# EAGLE design motorcontrol (EAGLE 7.7.0)
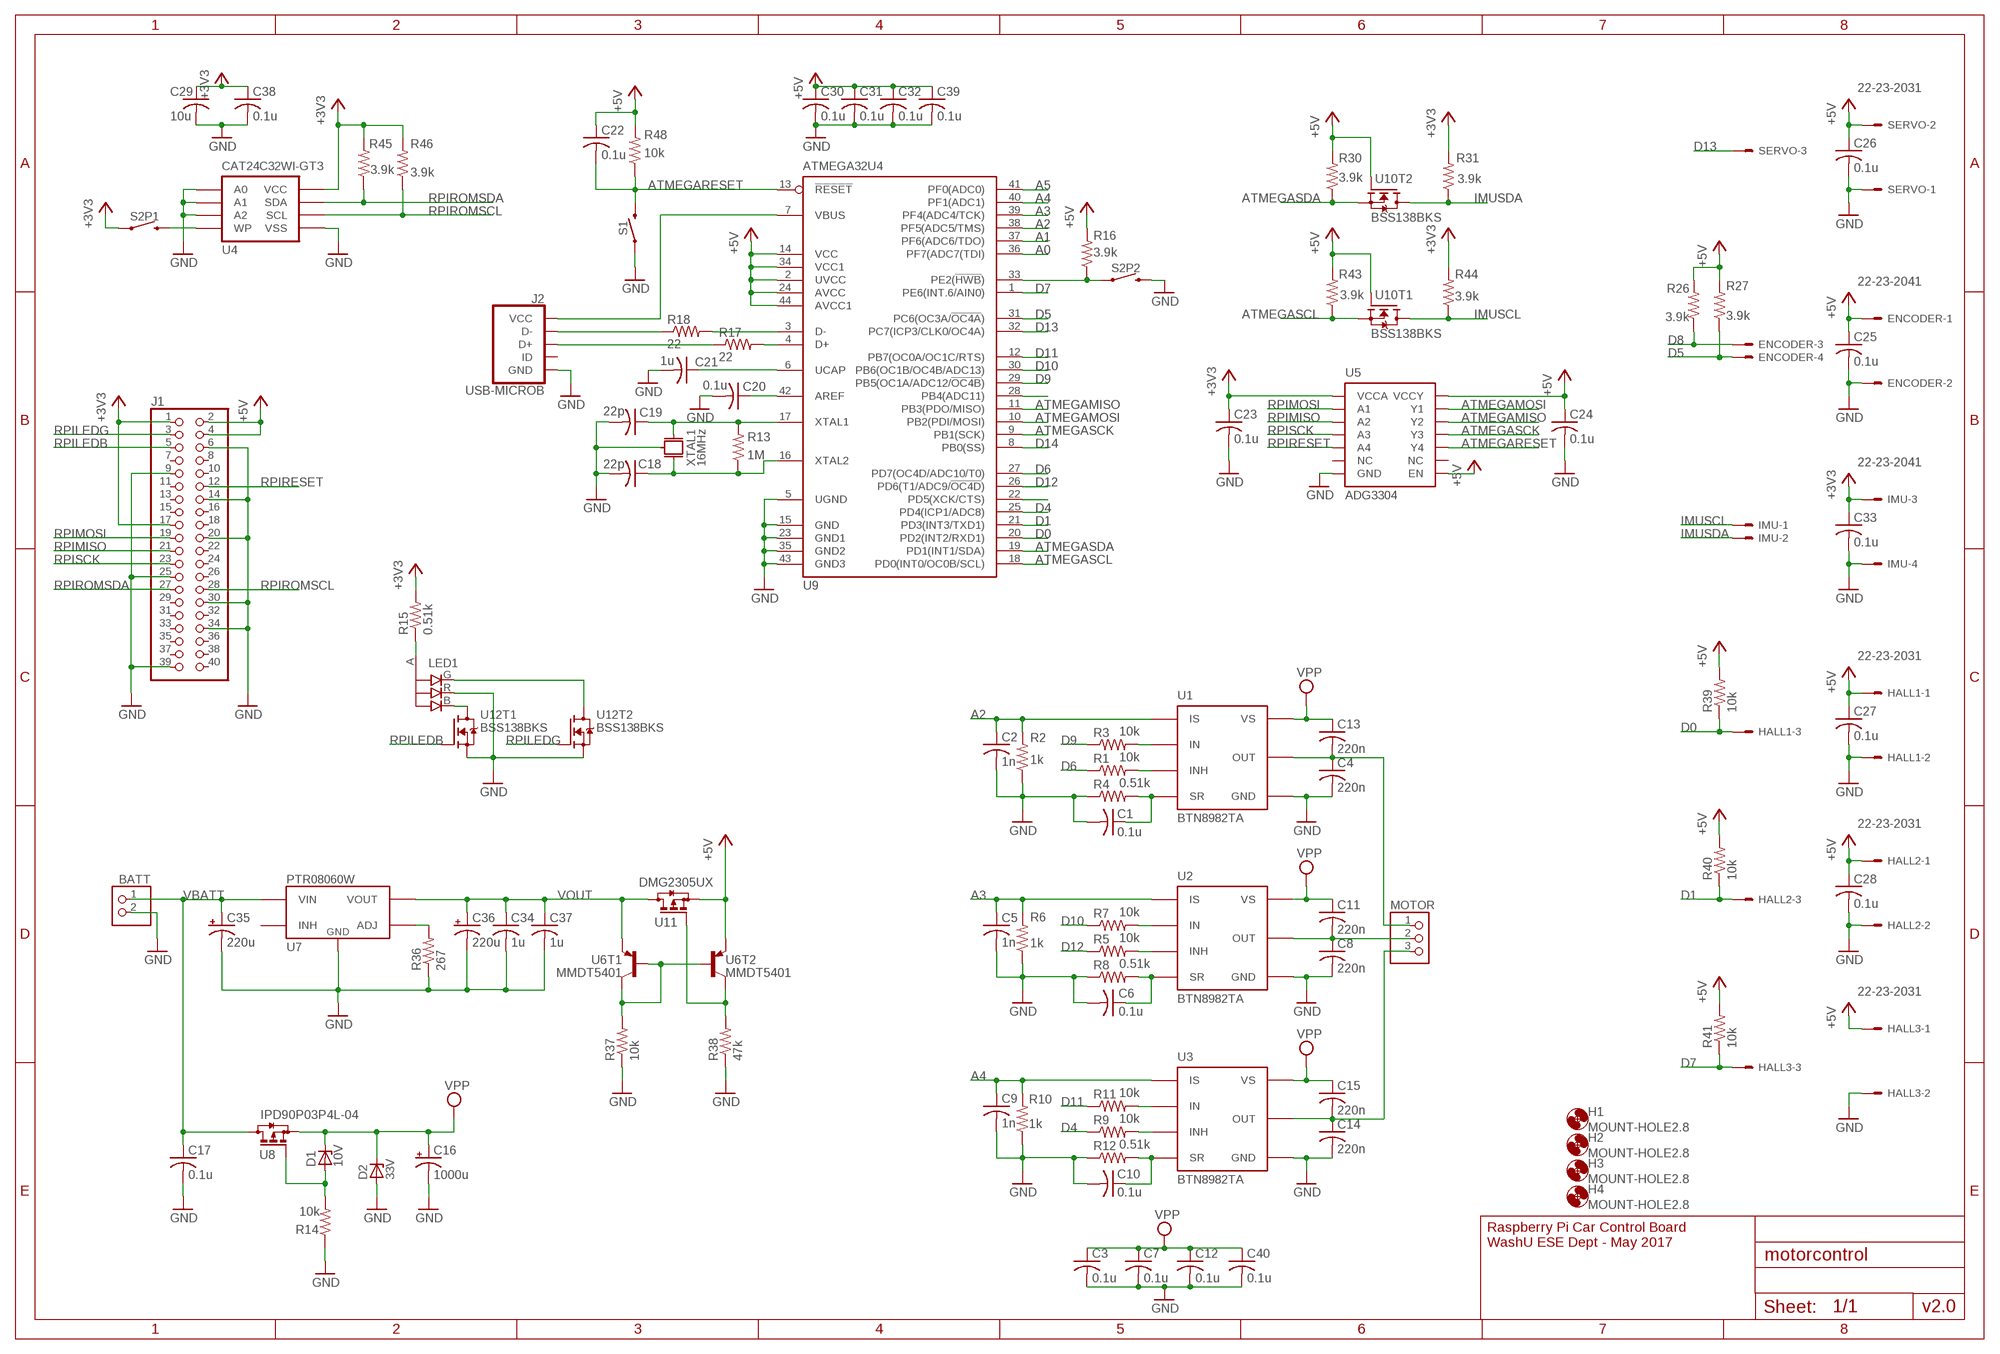
[diagram p0: schematic, sheet 1]

## Parts
BATT  ULTRAFIT_2CIRCVCLIP  [ULTRAFIT_2CIRC_VERTCLIP]
C1  0.1u  C-USC1206  [C1206]
C2  1n  C-USC1206  [C1206]
C3  0.1u  C-USC1206  [C1206]
C4  220n  C-USC1206  [C1206]
C5  1n  C-USC1206  [C1206]
C6  0.1u  C-USC1206  [C1206]
C7  0.1u  C-USC1206  [C1206]
C8  220n  C-USC1206  [C1206]
C9  1n  C-USC1206  [C1206]
C10  0.1u  C-USC1206  [C1206]
C11  220n  C-USC1206  [C1206]
C12  0.1u  C-USC1206  [C1206]
C13  220n  C-USC1206  [C1206]
C14  220n  C-USC1206  [C1206]
C15  220n  C-USC1206  [C1206]
C16  1000u  CPOL-USE5-10.5  [E5-10,5]
C17  0.1u  C-USC1206  [C1206]
C18  22p  C-USC1206  [C1206]
C19  22p  C-USC1206  [C1206]
C20  0.1u  C-USC1206  [C1206]
C21  1u  C-USC1206  [C1206]
C22  0.1u  C-USC1206  [C1206]
C23  0.1u  C-USC1206  [C1206]
C24  0.1u  C-USC1206  [C1206]
C25  0.1u  C-USC1206  [C1206]
C26  0.1u  C-USC1206  [C1206]
C27  0.1u  C-USC1206  [C1206]
C28  0.1u  C-USC1206  [C1206]
C29  10u  C-USC1206  [C1206]
C30  0.1u  C-USC1206  [C1206]
C31  0.1u  C-USC1206  [C1206]
C32  0.1u  C-USC1206  [C1206]
C33  0.1u  C-USC1206  [C1206]
C34  1u  C-USC1206  [C1206]
C35  220u  CPOL-USE3.5-8  [E3,5-8]
C36  220u  CPOL-USE3.5-8  [E3,5-8]
C37  1u  C-USC1206  [C1206]
C38  0.1u  C-USC1206  [C1206]
C39  0.1u  C-USC1206  [C1206]
C40  0.1u  C-USC1206  [C1206]
D1  10V  ZENER-DIODESOD80C  [SOD80C]
D2  33V  SMAZX  [SMA]
ENCODER  22-23-2041  [22-23-2041]
H1  MOUNT-HOLE2.8  [2,8]
H2  MOUNT-HOLE2.8  [2,8]
H3  MOUNT-HOLE2.8  [2,8]
H4  MOUNT-HOLE2.8  [2,8]
HALL1  22-23-2031  [22-23-2031]
HALL2  22-23-2031  [22-23-2031]
HALL3  22-23-2031  [22-23-2031]
IMU  22-23-2041  [22-23-2041]
J1  RPIHEADER_2.54-SMD  [RPI_SMD]
J2  USB-MICROB  [FCI-10103594-0001LF]
LED1  MSL0201RGB  [MSL0201RGB]
MOTOR  ULTRAFIT_3CIRCVCLIP  [ULTRAFIT_3CIRC_VERTCLIP]
R1  10k  R-US_R1206  [R1206]
R2  1k  R-US_R1206  [R1206]
R3  10k  R-US_R1206  [R1206]
R4  0.51k  R-US_R1206  [R1206]
R5  10k  R-US_R1206  [R1206]
R6  1k  R-US_R1206  [R1206]
R7  10k  R-US_R1206  [R1206]
R8  0.51k  R-US_R1206  [R1206]
R9  10k  R-US_R1206  [R1206]
R10  1k  R-US_R1206  [R1206]
R11  10k  R-US_R1206  [R1206]
R12  0.51k  R-US_R1206  [R1206]
R13  1M  R-US_R1206  [R1206]
R14  10k  R-US_R1206  [R1206]
R15  0.51k  R-US_R1206  [R1206]
R16  3.9k  R-US_R1206  [R1206]
R17  22  R-US_R1206  [R1206]
R18  22  R-US_R1206  [R1206]
R26  3.9k  R-US_R1206  [R1206]
R27  3.9k  R-US_R1206  [R1206]
R30  3.9k  R-US_R1206  [R1206]
R31  3.9k  R-US_R1206  [R1206]
R36  267  R-US_R1206  [R1206]
R37  10k  R-US_R1206  [R1206]
R38  47k  R-US_R1206  [R1206]
R39  10k  R-US_R1206  [R1206]
R40  10k  R-US_R1206  [R1206]
R41  10k  R-US_R1206  [R1206]
R43  3.9k  R-US_R1206  [R1206]
R44  3.9k  R-US_R1206  [R1206]
R45  3.9k  R-US_R1206  [R1206]
R46  3.9k  R-US_R1206  [R1206]
R48  10k  R-US_R1206  [R1206]
S1  B3U-3000P-B  [B3U-3000P-B]
S2  A6HF-2DIP  [A6HF]
SERVO  22-23-2031  [22-23-2031]
U1  BTN8982TA  [TO263-7]
U2  BTN8982TA  [TO263-7]
U3  BTN8982TA  [TO263-7]
U4  CAT24C32WI-GT3  [SOIC8]
U5  ADG3304  [TSSOP14]
U6  MMDT5401  [SOT363]
U7  PTR08060W  [EDP_MODULE]
U8  IPD90P03P4L-04  [TO252-3-11]
U9  ATMEGA32U4  [TQFP44]
U10  BSS138BKS  [SOT363]
U11  DMG2305UX  [SOT23-3]
U12  BSS138BKS  [SOT363]
XTAL1  16MHz  CRYSTAL  [ABM3B]

## Nets
+3V3: C23.1 C29.1 C33.1 C38.1 IMU.3 J1.1 J1.17 R15.2 R31.2 R44.2 R45.2 R46.2 S2.P1.1 U4.8(VCC) U5.1(VCCA)
+5V: C22.1 C24.1 C25.1 C26.1 C27.1 C28.1 C30.1 C31.1 C32.1 C39.1 ENCODER.1 HALL1.1 HALL2.1 HALL3.1 J1.2 J1.4 R16.2 R26.2 R27.2 R30.2 R39.2 R40.2 R41.2 R43.2 R48.2 SERVO.2 U5.8(EN) U5.14(VCCY) U6.4(T2:E) U9.2(UVCC) U9.14(VCC) U9.24(AVCC) U9.34(VCC1) U9.44(AVCC1) U10.2(T1:G) U10.5(T2:G) U11.2(S)
A0: U9.36(PF7(ADC7(TDI))
A1: U9.37(PF6(ADC6/TDO))
A2: C2.1 R2.2 U1.6(IS) U9.38(PF5(ADC5/TMS))
A3: C5.1 R6.2 U2.6(IS) U9.39(PF4(ADC4/TCK))
A4: C9.1 R10.2 U3.6(IS) U9.40(PF1(ADC1))
A5: U9.41(PF0(ADC0))
ATMEGAMISO: U5.12(Y2) U9.11(PB3(PDO/MISO))
ATMEGAMOSI: U5.13(Y1) U9.10(PB2(PDI/MOSI))
ATMEGARESET: C22.2 R48.1 S1.2 U5.10(Y4) U9.13(!RESET!)
ATMEGASCK: U5.11(Y3) U9.9(PB1(SCK))
ATMEGASCL: R43.1 U9.18(PD0(INT0/OC0B/SCL)) U10.1(T1:S)
ATMEGASDA: R30.1 U9.19(PD1(INT1/SDA)) U10.4(T2:S)
D0: HALL1.3 R39.1 U9.20(PD2(INT2/RXD1))
D1: HALL2.3 R40.1 U9.21(PD3(INT3/TXD1))
D4: R9.1 U9.25(PD4(ICP1/ADC8))
D5: ENCODER.4 R27.1 U9.31(PC6(OC3A/!OC4A!))
D6: R1.1 U9.27(PD7(OC4D/ADC10/T0))
D7: HALL3.3 R41.1 U9.1(PE6(INT.6/AIN0))
D8: ENCODER.3 R26.1 U9.28(PB4(ADC11))
D9: R3.1 U9.29(PB5(OC1A/ADC12/!OC4B!))
D10: R7.1 U9.30(PB6(OC1B/OC4B/ADC13))
D11: R11.1 U9.12(PB7(OC0A/OC1C/RTS))
D12: R5.1 U9.26(PD6(T1/ADC9/!OC4D!))
D13: SERVO.3 U9.32(PC7(ICP3/CLK0/OC4A))
D14: U9.8(PB0(SS))
GND: BATT.2 C1.2 C2.2 C3.2 C4.2 C5.2 C6.2 C7.2 C8.2 C9.2 C10.2 C12.2 C14.2 C16.- C17.2 C18.2 C19.2 C20.2 C21.2 C23.2 C24.2 C25.2 C26.2 C27.2 C28.2 C29.2 C30.2 C31.2 C32.2 C33.2 C34.2 C35.- C36.- C37.2 C38.2 C39.2 C40.2 D2.A ENCODER.2 HALL1.2 HALL2.2 HALL3.2 IMU.4 J1.6 J1.9 J1.14 J1.20 J1.25 J1.30 J1.34 J1.39 J2.5(GND) J2.GND1(GND) J2.GND2(GND) LED1.R R2.1 R4.1 R6.1 R8.1 R10.1 R12.1 R14.1 R36.1 R37.1 R38.1 S1.1 S2.P2.2 SERVO.1 U1.1(GND) U2.1(GND) U3.1(GND) U4.1(A0) U4.2(A1) U4.3(A2) U4.4(VSS) U5.7(GND) U7.P3(GND) U9.5(UGND) U9.15(GND) U9.23(GND1) U9.35(GND2) U9.43(GND3) U12.1(T1:S) U12.4(T2:S) XTAL1.GND2 XTAL1.GND4
IMUSCL: IMU.1 R44.1 U10.6(T1:D)
IMUSDA: IMU.2 R31.1 U10.3(T2:D)
N$1: R1.2 U1.3(INH)
N$2: R38.2 U6.3(T2:C) U11.1(G)
N$3: C18.1 R13.1 U9.16(XTAL2) XTAL1.P3
N$4: R3.2 U1.2(IN)
N$5: C1.1 R4.2 U1.5(SR)
N$6: R5.2 U2.3(INH)
N$7: C19.1 R13.2 U9.17(XTAL1) XTAL1.P1
N$8: R16.1 S2.P2.1 U9.33(PE2(!HWB!))
N$9: R7.2 U2.2(IN)
N$10: LED1.A R15.1
N$11: C6.1 R8.2 U2.5(SR)
N$12: S2.P1.2 U4.7(WP)
N$13: R37.2 U6.2(T1:B) U6.5(T2:B) U6.6(T1:C)
N$14: LED1.B U12.6(T1:D)
N$15: R9.2 U3.3(INH)
N$16: J2.2(D-) R18.1
N$17: R11.2 U3.2(IN)
N$18: C10.1 R12.2 U3.5(SR)
N$19: C20.1 U9.42(AREF)
N$20: C21.1 U9.6(UCAP)
N$21: D1.A R14.2 U8.1(G)
N$22: LED1.G U12.3(T2:D)
N$23: R18.2 U9.3(D-)
N$24: R17.2 U9.4(D+)
N$25: J2.3(D+) R17.1
N$41: R36.2 U7.P5(ADJ)
N$48: U9.22(PD5(XCK/CTS))
OUT1: C4.1 C13.2 MOTOR.1 U1.4(OUT) U1.8(OUT)
OUT2: C8.1 C11.2 MOTOR.2 U2.4(OUT) U2.8(OUT)
OUT3: C14.1 C15.2 MOTOR.3 U3.4(OUT) U3.8(OUT)
RPILEDB: J1.5 U12.2(T1:G)
RPILEDG: J1.3 U12.5(T2:G)
RPIMISO: J1.21 U5.3(A2)
RPIMOSI: J1.19 U5.2(A1)
RPIRESET: J1.12 U5.5(A4)
RPIROMSCL: J1.28 R46.1 U4.6(SCL)
RPIROMSDA: J1.27 R45.1 U4.5(SDA)
RPISCK: J1.23 U5.4(A3)
VBATT: BATT.1 C17.1 C35.+ U7.P2(VIN) U8.2(D)
VBUS: J2.1(VCC) U9.7(VBUS)
VOUT: C34.1 C36.+ C37.1 U6.1(T1:E) U7.P4(VOUT) U11.3(D)
VPP: C3.1 C7.1 C11.1 C12.1 C13.1 C15.1 C16.+ C40.1 D1.C D2.C U1.7(VS) U2.7(VS) U3.7(VS) U8.3(S)
Unconnected: J1.7 J1.8 J1.10 J1.11 J1.13 J1.15 J1.16 J1.18 J1.22 J1.24 J1.26 J1.29 J1.31 J1.32 J1.33 J1.35 J1.36 J1.37 J1.38 J1.40 J2.4(ID) U5.6(NC) U5.9(NC) U7.P1(INH)

## Notes on the sheet
- Raspberry Pi Car Control Board
  WashU ESE Dept - May 2017
- v2.0

## Library data of the parts
BATT = rpibout:ULTRAFIT_2CIRC: Molex Ultra-Fit, 3.50mm Pitch, Single Row, 2 Circuits
C1-C15 C17-C34 C37-C40 = resistor:C-US: CAPACITOR, American symbol
C16 C35 C36 = resistor:CPOL-US: POLARIZED CAPACITOR, American symbol
D1 = diode:ZENER-DIODE: Z-Diode
D2 = rpibout:SMAZX: SMAZxx Zener Diode
ENCODER IMU = con-molex:22-23-2041: .100" (2.54mm) Center Header - 4 Pin; MF: MOLEX; MPN: 22-23-2041; OC_FARNELL: 1462920; OC_NEWARK: 38C0355
H1-H4 = holes:MOUNT-HOLE: MOUNTING HOLE with drill center marker
HALL1-HALL3 SERVO = con-molex:22-23-2031: .100" (2.54mm) Center Header - 3 Pin; MF: MOLEX; MPN: 22-23-2031; OC_FARNELL: 1462950; OC_NEWARK: 30C0862
J1 = rpibout:RPIHEADER: PIN HEADER
J2 = rpibout:USB-MICROB: USB Receptable
LED1 = rpibout:MSL0201RGB: MSL0201RGB Right Angle SMD RGB LED
MOTOR = rpibout:ULTRAFIT_3CIRC: Molex Ultra-Fit, 3.50mm Pitch, Single Row, 3 Circuits
R1-R18 R26 R27 R30 R31 R36-R41 R43-R46 R48 = resistor:R-US_: RESISTOR, American symbol
S1 = rpibout:B3U-3000P-B: B3U Ultra-small Switch, side actuated, with boss
S2 = rpibout:A6HF-2DIP: 2 Port Slide DIP Switch
U1-U3 = rpibout:BTN8982TA: BTN8982TA High Current PN Half Bridge
U4 = rpibout:CAT24C32WI-GT3: CAT24C32 32Kb EEPROM, SOIC-8 package
U5 = rpibout:ADG3304: ADG3304 Analog Devices Bidirectional Voltage Level Translator
U6 = rpibout:MMDT5401: Dual PNP Small Signal Transistor
U7 = rpibout:PTR08060W: PTR08060W Texas Instruments Buck Power Module
U8 = rpibout:IPD90P03P4L-04: IPD90P03P4L-04 P-Channel MOSFET
U9 = rpibout:ATMEGA32U4: ATMEL Mega 32U4 Microcontroller
U10 U12 = rpibout:BSS138BKS: BSS138BKS Dual N-MOSFET
U11 = rpibout:DMG2305UX: DMG2305 P-Channel MOSFET
XTAL1 = rpibout:CRYSTAL: ABM3B Ceramic SMD Crystal

## Net classes
1 pwr: width 0.305 mm
3 vcc: width 0.152 mm, drill 0.305 mm, clearance 0.152 mm

## Board
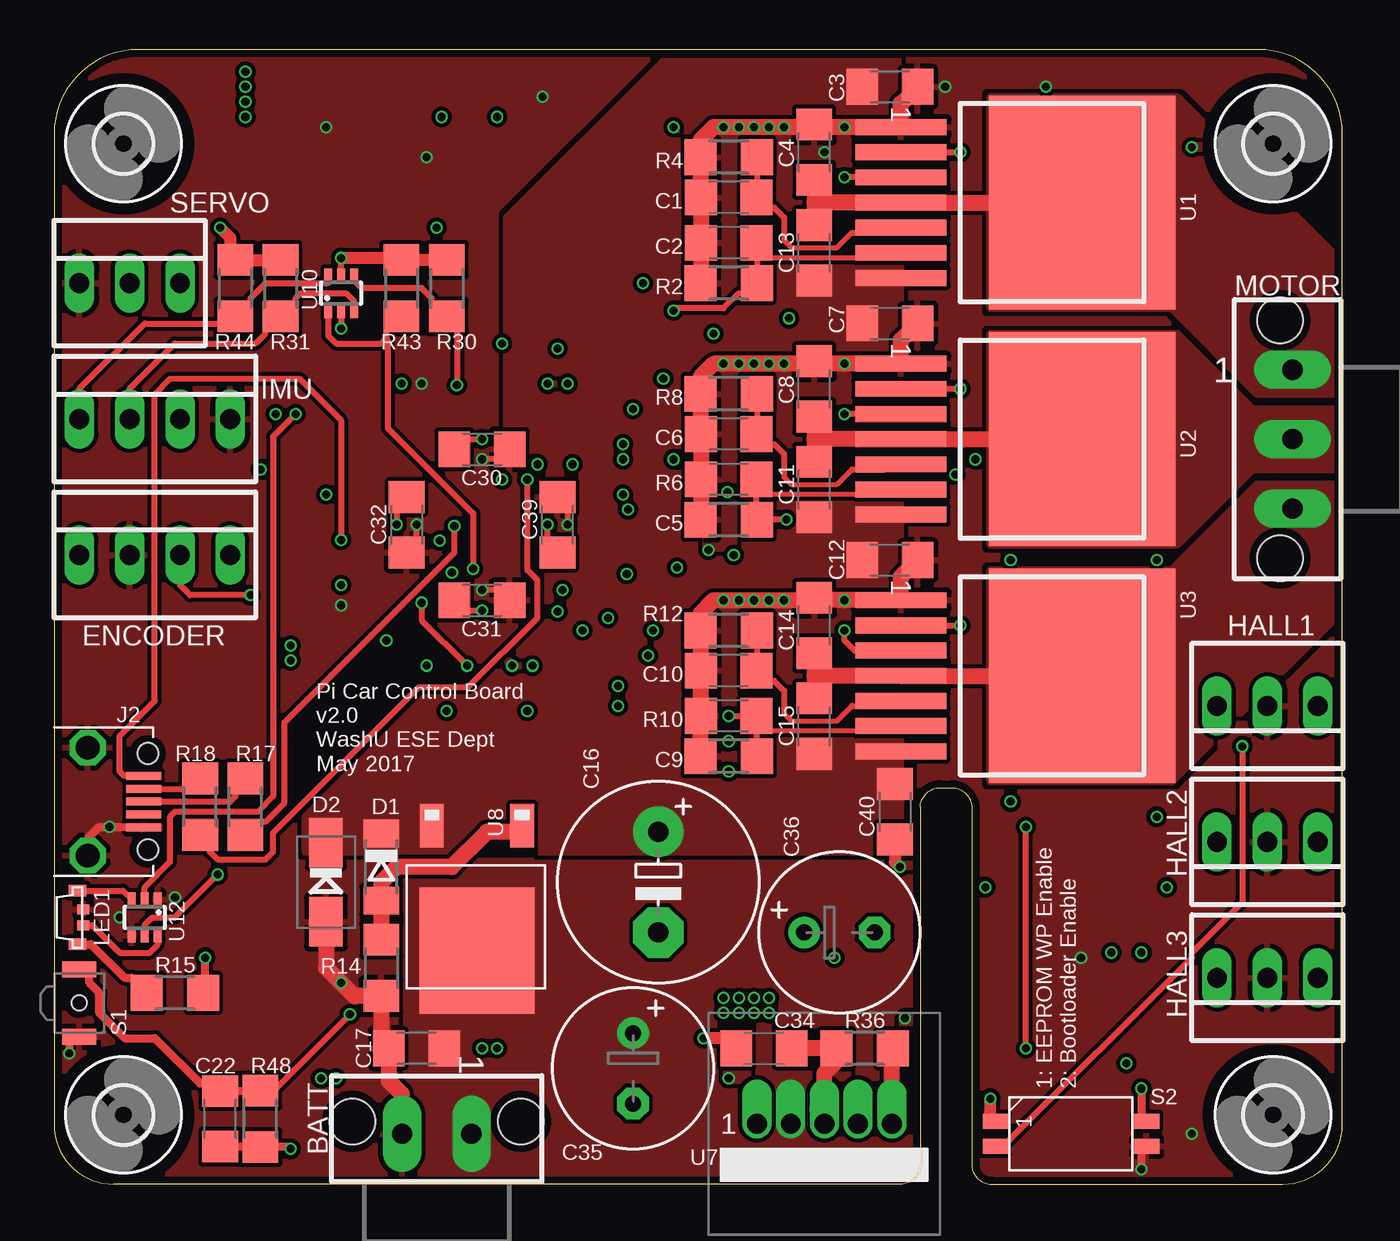
[diagram p1: board, top side]
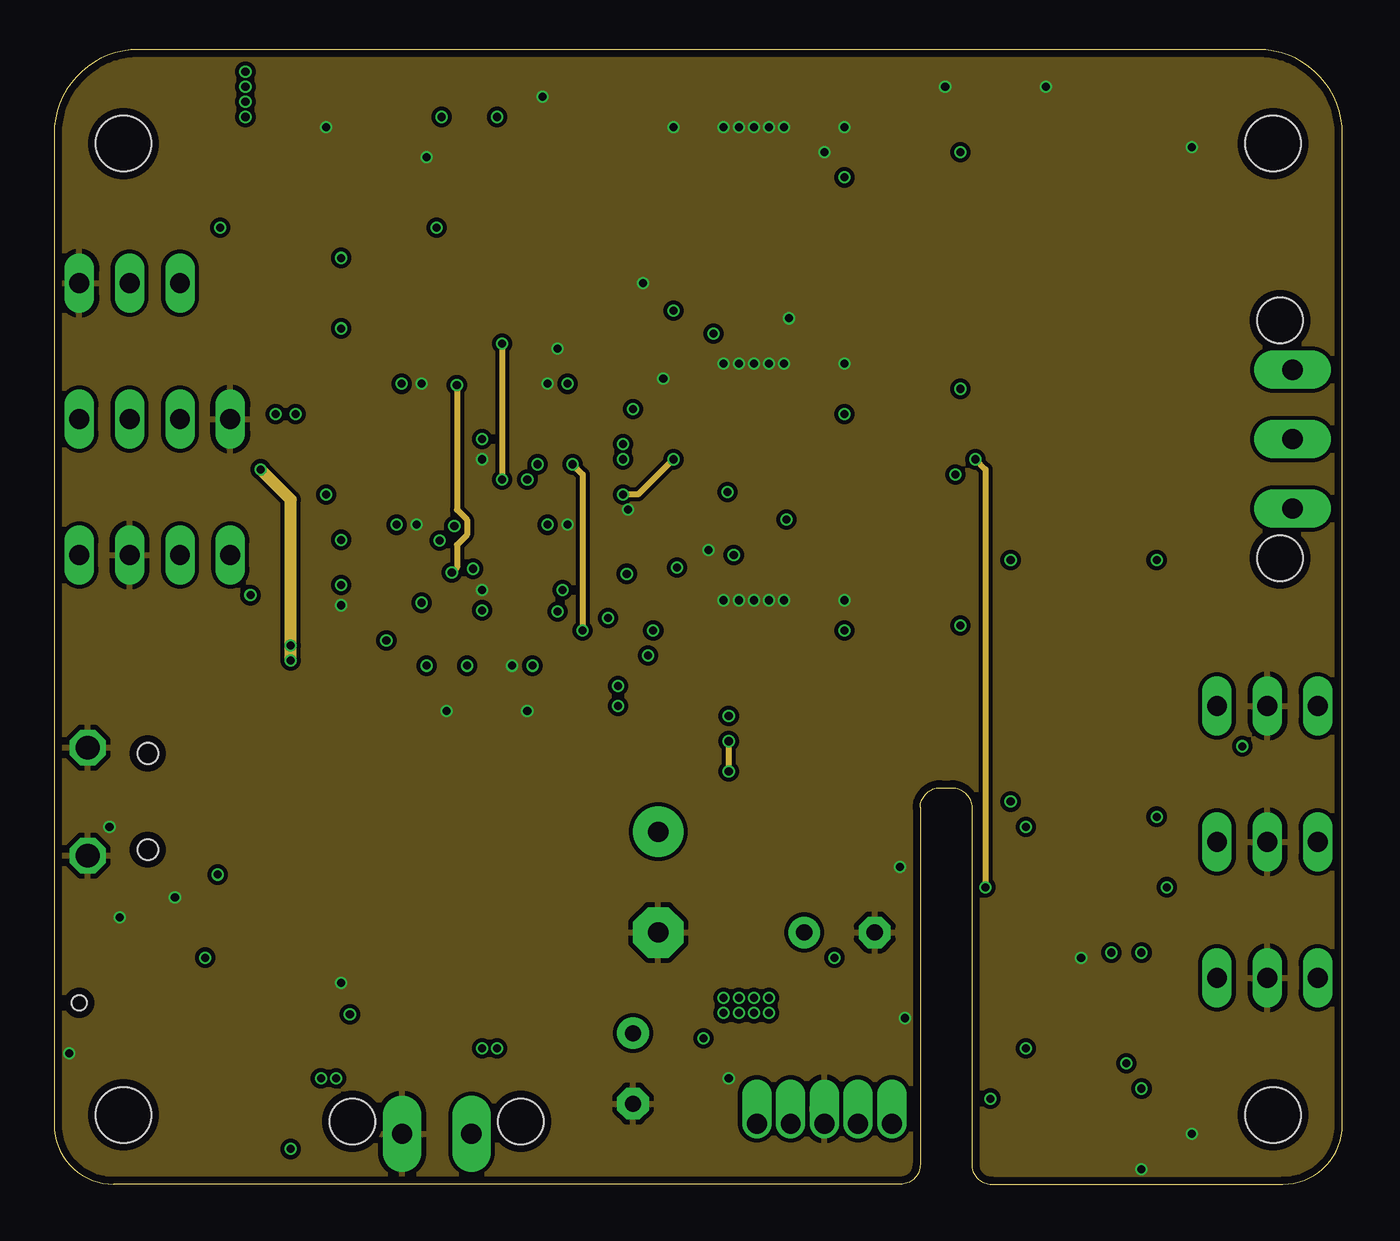
[diagram p2: board, inner layer Route2]
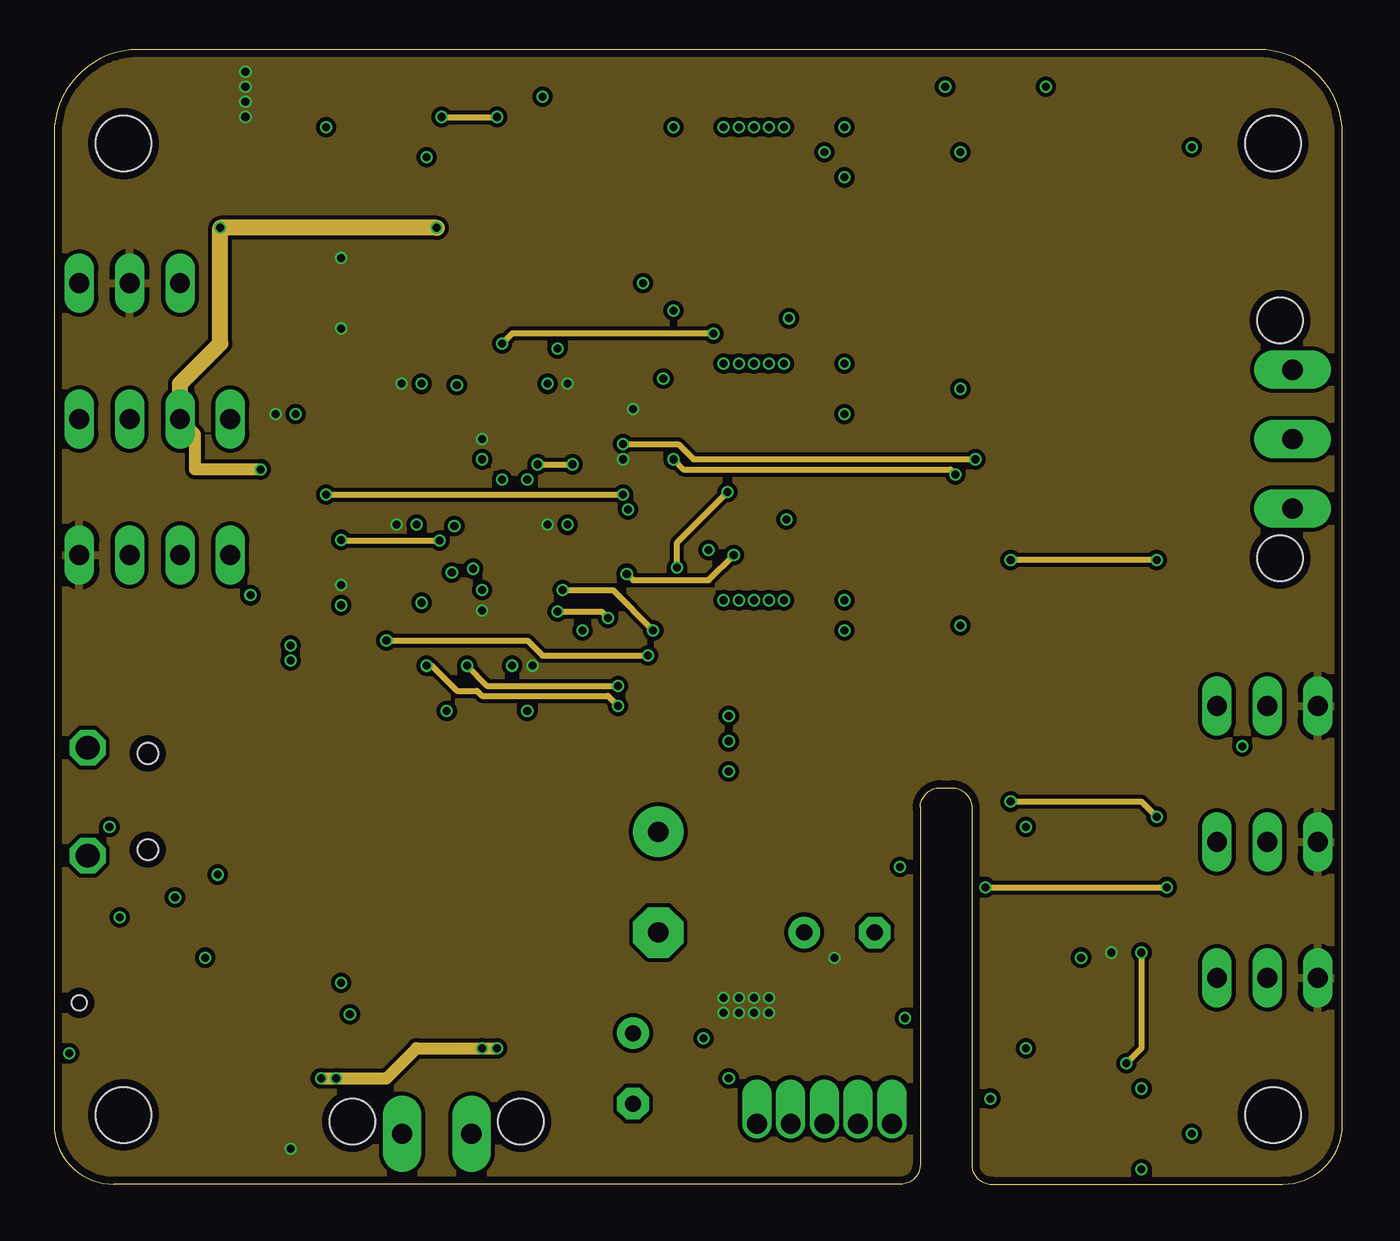
[diagram p3: board, inner layer Route15]
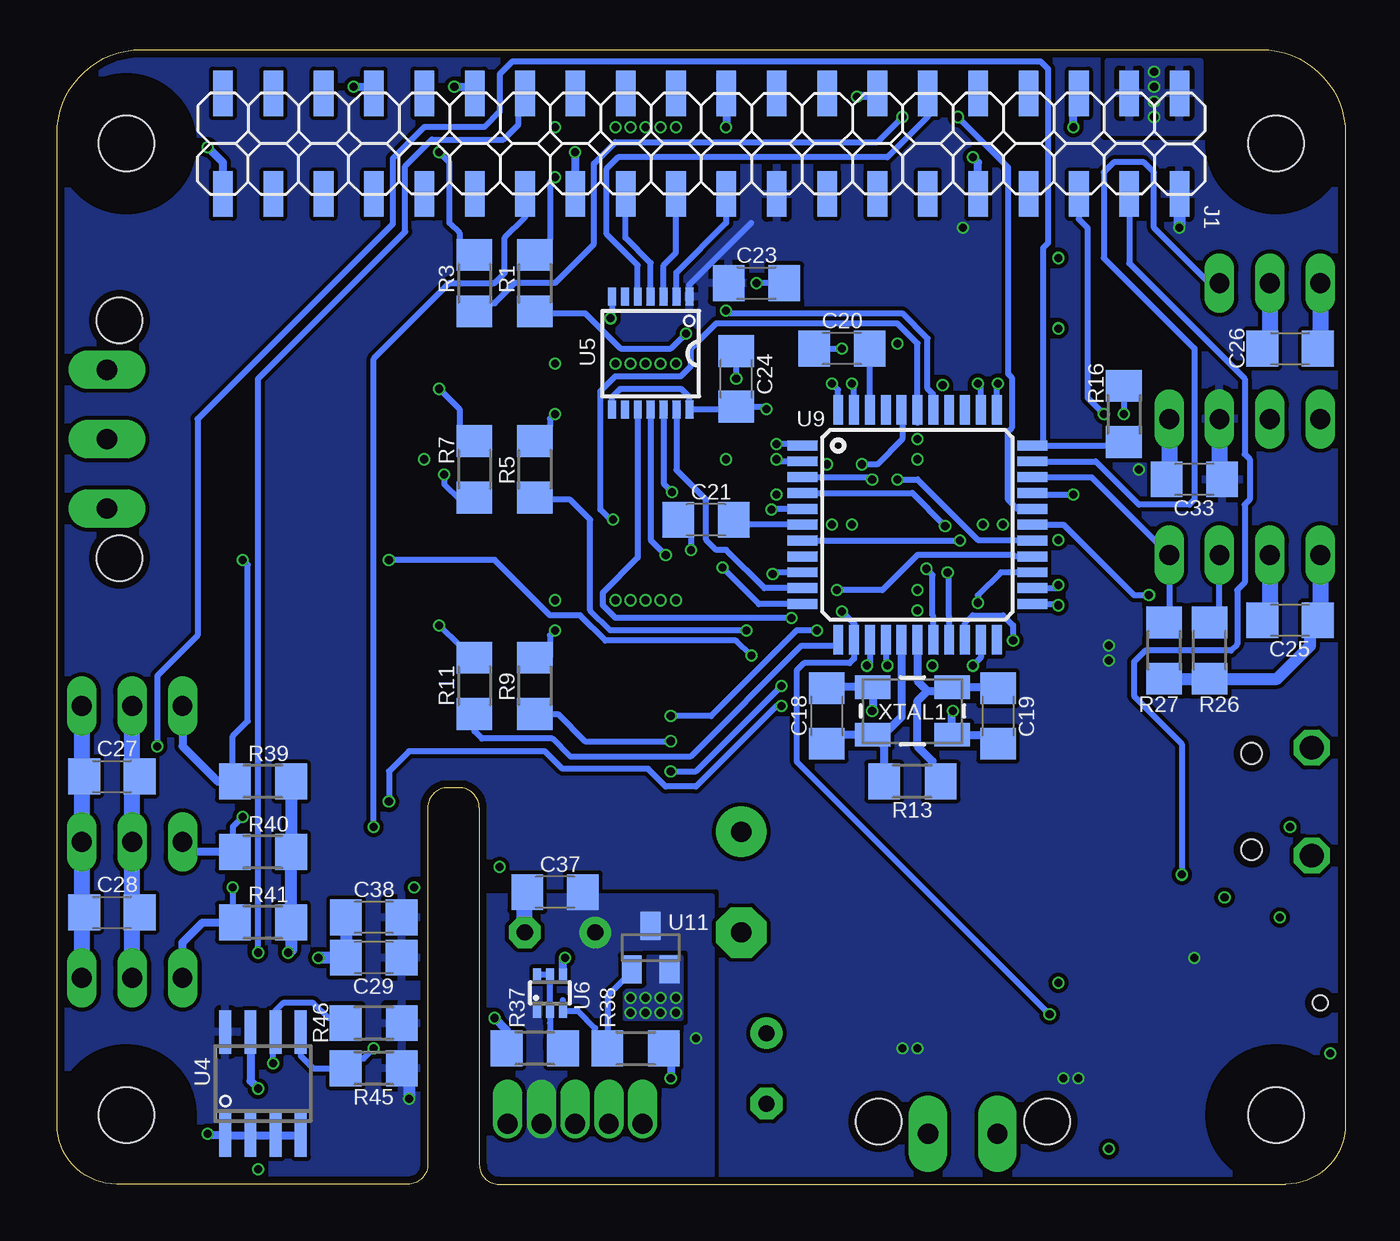
[diagram p4: board, bottom side, seen from below]

Size 65 x 57.25 mm. Coordinates in mm from the lower left corner, seen from the top.
Outline: 65,3 65,53 arc90 60.75,57.25 4.25,57.25 arc90 0,53 0,3 arc90 3,0 42.7,0 arc90 43.7,1 43.7,19 arc-90 44.7,20 45.3,20 arc-90 46.3,19 46.3,1 arc90 47.3,0 62,0 arc90 65,3
Copper layers (1*2*15*16): Top 0.035559375mm / dielectric 0.17018125mm / Route2 0.01778125mm / dielectric 47mil / Route15 0.01778125mm / dielectric 0.17018125mm / Bottom 0.035559375mm
Design rules "OSHPark-4layer *": minimum track width 10mil, minimum drill 16mil, track to track 8mil, track to pad 8mil, pad to pad 7mil, via to via 5mil, smd to smd 5mil, copper to edge 15mil, drill to drill 6mil, minimum pad ring 4mil, minimum via ring 4mil, stop-mask expansion 2.5mil, vias tented up to drill 0mil, thermal gap 10mil

### Footprints (pad centres in the part's own frame; a part is rotated, then mirrored left to right if it is on the bottom)
ULTRAFIT_2CIRC_VERTCLIP = drill 1.02 pad 1.93 long: 1 -1.75,0; 2 1.75,0 | hole 2.3: -4.25,-0.63; 4.25,-0.63
C1206 = smd 1.6 x 1.8: 1 -1.4,0; 2 1.4,0
E5-10,5 = drill 1.016 pad 2.54: + -2.54,0 | drill 1.016 pad 2.54 octagon: - 2.54,0
E3,5-8 = drill 0.813 pad 1.6: + -1.778,0 | drill 0.813 pad 1.6 octagon: - 1.778,0
SOD80C = smd 1.4 x 1.8: A 1.7,0; C -1.7,0
SMA = smd 2.5 x 1.7: A 2,0; C -2,0
22-23-2041 = drill 1 long: 1 -3.81,0; 2 -1.27,0; 3 1.27,0; 4 3.81,0
2,8 = hole 2.8: 0,0
22-23-2031 = drill 1 long: 1 -2.54,0; 2 0,0; 3 2.54,0
RPI_SMD = smd 0.991 x 2.286 bottom: 1 -24.13,-2.54; 2 -24.13,2.54; 3 -21.59,-2.54; 4 -21.59,2.54; 5 -19.05,-2.54; 6 -19.05,2.54; 7 -16.51,-2.54; 8 -16.51,2.54; 9 -13.97,-2.54; 10 -13.97,2.54; 11 -11.43,-2.54; 12 -11.43,2.54; 13 -8.89,-2.54; 14 -8.89,2.54; 15 -6.35,-2.54; 16 -6.35,2.54; 17 -3.81,-2.54; 18 -3.81,2.54; 19 -1.27,-2.54; 20 -1.27,2.54; 21 1.27,-2.54; 22 1.27,2.54; 23 3.81,-2.54; 24 3.81,2.54; 25 6.35,-2.54; 26 6.35,2.54; 27 8.89,-2.54; 28 8.89,2.54; 29 11.43,-2.54; 30 11.43,2.54; 31 13.97,-2.54; 32 13.97,2.54; 33 16.51,-2.54; 34 16.51,2.54; 35 19.05,-2.54; 36 19.05,2.54; 37 21.59,-2.54; 38 21.59,2.54; 39 24.13,-2.54; 40 24.13,2.54
FCI-10103594-0001LF = smd 0.4 x 1.75: 1 -1.3,4.525; 2 -0.65,4.525; 3 0,4.525; 4 0.65,4.525; 5 1.3,4.525 | drill 1.2 octagon: GND1 -2.725,1.7; GND2 2.725,1.7 | hole 1.05: -2.425,4.73; 2.425,4.73
MSL0201RGB = smd 0.6 x 0.9: A -1.35,0.6; G 1.35,0.6 | smd 0.5 x 0.6: B -0.4,0.3; R 0.4,0.3
ULTRAFIT_3CIRC_VERTCLIP = drill 1.02 pad 1.93 long: 1 -3.5,0; 2 0,0; 3 3.5,0 | hole 2.3: -6,-0.63; 6,-0.63
R1206 = smd 1.6 x 1.803: 1 -1.422,0; 2 1.422,0
B3U-3000P-B = smd 0.8 x 1.7: 1 -1.7,0; 2 1.7,0 | hole 0.75: 0,0
A6HF = smd 0.76 x 1.27: P1.1 -0.635,-3.81; P1.2 -0.635,3.81; P2.1 0.635,-3.81; P2.2 0.635,3.81
TO263-7 = smd 4.6 x 0.8: 1 -3,3.81; 2 -3,2.54; 3 -3,1.27; 4 -3,0; 5 -3,-1.27; 6 -3,-2.54; 7 -3,-3.81 | smd 9.4 x 10.8: 8 6.15,0
SOIC8 = smd 0.6 x 2.2: 1 -1.905,-2.6; 2 -0.635,-2.6; 3 0.635,-2.6; 4 1.905,-2.6; 5 1.905,2.6; 6 0.635,2.6; 7 -0.635,2.6; 8 -1.905,2.6
TSSOP14 = smd 0.9 x 0.4: 1 -2.875,1.95; 2 -2.875,1.3; 3 -2.875,0.65; 4 -2.875,0; 5 -2.875,-0.65; 6 -2.875,-1.3; 7 -2.875,-1.95; 8 2.825,-1.95; 9 2.825,-1.3; 10 2.825,-0.65; 11 2.825,0; 12 2.825,0.65; 13 2.825,1.3; 14 2.825,1.95
SOT363 = smd 0.4 x 0.7: 1 -0.65,-0.9; 2 0,-0.9; 3 0.65,-0.9; 4 0.65,0.9; 5 0,0.9; 6 -0.65,0.9
EDP_MODULE = drill 1 pad 1.27 offset: P1 3.404,0; P2 1.702,0; P3 0,0; P4 -1.702,0; P5 -3.404,0
TO252-3-11 = smd 1.2 x 2.2: 1 -2.28,-3.1; 3 2.28,-3.1 | smd 5.8 x 6.4: 2 0,3.2
TQFP44 = smd 1.5 x 0.5: 1 -5.8,4; 2 -5.8,3.2; 3 -5.8,2.4; 4 -5.8,1.6; 5 -5.8,0.8; 6 -5.8,0; 7 -5.8,-0.8; 8 -5.8,-1.6; 9 -5.8,-2.4; 10 -5.8,-3.2; 11 -5.8,-4; 23 5.8,-4; 24 5.8,-3.2; 25 5.8,-2.4; 26 5.8,-1.6; 27 5.8,-0.8; 28 5.8,0; 29 5.8,0.8; 30 5.8,1.6; 31 5.8,2.4; 32 5.8,3.2; 33 5.8,4 | smd 0.5 x 1.5: 12 -4,-5.8; 13 -3.2,-5.8; 14 -2.4,-5.8; 15 -1.6,-5.8; 16 -0.8,-5.8; 17 0,-5.8; 18 0.8,-5.8; 19 1.6,-5.8; 20 2.4,-5.8; 21 3.2,-5.8; 22 4,-5.8; 34 4,5.8; 35 3.2,5.8; 36 2.4,5.8; 37 1.6,5.8; 38 0.8,5.8; 39 0,5.8; 40 -0.8,5.8; 41 -1.6,5.8; 42 -2.4,5.8; 43 -3.2,5.8; 44 -4,5.8
SOT23-3 = smd 1 x 1.4: 1 -0.95,-1.1; 2 0.95,-1.1; 3 0,1.1
ABM3B = smd 1.8 x 1.2: GND2 2,-1.2; GND4 -2,1.2; P1 -2,-1.2; P3 2,1.2

### Placement (x,y rotation side)
BATT  19.3,2.54 180 top
C1  34.04,49.78 180 top
C2  34.04,47.5 180 top
C3  42.16,55.37 0 top
C4  38.35,52.07 90 top
C5  34.04,35.56 180 top
C6  34.04,37.85 180 top
C7  42.16,43.43 0 top
C8  38.35,40.13 90 top
C9  34.04,23.62 180 top
C10  34.04,25.91 180 top
C11  38.35,35.05 90 top
C12  42.16,31.5 0 top
C13  38.35,46.99 90 top
C14  38.35,28.19 90 top
C15  38.35,23.11 90 top
C16  30.48,15.24 270 top
C17  18.29,6.86 180 top
C18  26.16,23.62 90 bottom
C19  17.53,23.62 270 bottom
C20  25.4,42.16 180 bottom
C21  32.26,33.53 180 bottom
C22  8.38,3.3 90 top
C23  29.72,45.47 0 bottom
C24  30.73,40.64 90 bottom
C25  2.79,28.45 180 bottom
C26  2.79,42.16 0 bottom
C27  62.23,20.57 0 bottom
C28  62.23,13.72 0 bottom
C29  49.02,11.43 180 bottom
C30  21.59,37.08 0 top
C31  21.59,29.46 0 top
C32  17.78,33.27 270 top
C33  7.62,35.56 180 bottom
C34  35.81,6.86 0 top
C35  29.21,5.84 270 top
C36  39.62,12.7 0 top
C37  39.88,14.73 180 bottom
C38  49.02,13.46 180 bottom
C39  25.4,33.27 90 top
C40  42.42,18.8 270 top
D1  16.51,16 270 top
D2  13.72,15.24 270 top
ENCODER  5.08,31.75 0 top
H1  3.5,3.5 0 top
H2  3.5,52.5 0 top
H3  61.5,52.5 0 top
H4  61.5,3.5 0 top
HALL1  61.21,24.13 180 top
HALL2  61.21,17.27 180 top
HALL3  61.21,10.41 180 top
IMU  5.08,38.61 0 top
J1  32.5,52.5 0 top
J2  0,19.3 270 top
LED1  1.78,13.46 90 top
MOTOR  62.48,37.59 270 top
R1  40.89,45.47 90 bottom
R2  34.04,45.47 0 top
R3  43.94,45.47 90 bottom
R4  34.04,51.82 0 top
R5  40.89,36.07 90 bottom
R6  34.04,33.53 0 top
R7  43.94,36.07 90 bottom
R8  34.04,39.88 0 top
R9  40.89,25.15 90 bottom
R10  34.04,21.59 0 top
R11  43.94,25.15 90 bottom
R12  34.04,27.94 0 top
R13  21.84,20.32 0 bottom
R14  16.51,10.92 90 top
R15  6.1,9.65 0 top
R16  11.18,38.86 90 bottom
R17  9.65,19.05 270 top
R18  7.37,19.05 270 top
R26  6.86,26.92 270 bottom
R27  9.14,26.92 270 bottom
R30  19.81,45.21 90 top
R31  11.43,45.21 90 top
R36  40.89,6.86 0 top
R37  40.89,6.86 0 bottom
R38  35.81,6.86 180 bottom
R39  54.61,20.32 0 bottom
R40  54.61,16.76 0 bottom
R41  54.61,13.21 0 bottom
R43  17.53,45.21 90 top
R44  9.14,45.21 90 top
R45  49.02,5.84 0 bottom
R46  49.02,8.13 0 bottom
R48  10.41,3.3 270 top
S1  1.27,9.14 90 top
S2  51.31,2.54 270 top
SERVO  3.81,45.47 0 top
U1  45.72,49.53 0 top
U2  45.72,37.59 0 top
U3  45.72,25.65 0 top
U4  54.61,5.08 0 bottom
U5  35.05,41.91 270 bottom
U6  40.13,9.65 0 bottom
U7  38.86,3.05 180 top
U8  21.34,14.99 180 top
U9  21.59,33.27 0 bottom
U10  14.48,44.96 0 top
U11  35.05,11.94 0 bottom
U12  4.57,13.46 180 top
XTAL1  21.84,23.88 180 bottom

### Tracks (layer width: path | path; a pad name or v marks a point on that pad's centre or on a via)
+3V3  (via drill 0.41)
  Top 0.305: R15.2 7.62,9.75
  Top 0.406: 7.62,9.75 v7.62,11.43
  Top 0.61: S2.P1.1 47.24,3.17 47.24,3.3 v47.24,4.32 | v8.38,48.26 8.89,47.75 8.89,46.89 R44.2 R31.2
  Route2 0.61: v10.41,36.07 11.94,34.54 v11.94,27.18 v11.94,26.42
  Route15 0.61: v10.41,36.07 7.11,36.07 7.11,37.85 IMU.3 | v13.46,5.33 v14.22,5.33 16.76,5.33 18.29,6.86 v21.59,6.86 v22.35,6.86
  Route15 0.813: IMU.3 6.35,40.39 8.38,42.42 v8.38,48.26 v19.3,48.26
  Bottom 0.305: 29.97,48.51 33.1,45.38 U5.1 33.02,44.7 | 28.7,49.95 J1.17
  Bottom 0.61: 47.24,5.74 v47.24,4.32 | J1.1 8.37,48.27 v8.38,48.26
  Bottom 0.813: IMU.3 6.35,35.69 C33.1
  pour Bottom (rank 5): -0.76,58.67 65.79,58.67 65.79,-0.76 -0.76,-0.76
+5V  (via drill 0.41)
  Top 0.305: U10.5 v14.48,46.74 | U10.2 v14.48,43.18 | C32.1 17.78,34.54 17.27,34.04 v17.27,33.27 | C30.1 20.32,37.08 20.83,37.59 v21.59,37.59 | C39.1 25.4,32 24.89,32.51 v24.89,33.27 | C31.1 20.32,29.46 20.83,28.96 v21.59,28.96
  Top 0.406: R48.2 10.39,1.9 C22.1 11.81,1.9 v11.94,1.78
  Top 0.61: R30.2 R43.2 17.42,46.74 v14.48,46.74
  Bottom 0.305: U5.8 37,39.71 36.58,40.13 33.53,40.13 33.1,39.71 U5.14 30.89,39.09 C24.1 29.33,39.24 v29.21,39.12 | R16.2 v11.18,38.86 | U9.34 17.59,40.32 v17.53,40.39 | U9.44 25.59,40.07 v25.91,40.39 | U9.2 28.6,36.47 v28.7,36.58 | U9.14 23.99,26.3 v24.13,26.16 | U9.24 14.63,30.07 v14.48,30.23
  Bottom 0.406: U6.4 39.48,11.32 v39.37,11.43
  Bottom 0.61: v53.34,11.68 53.19,11.84 R41.2 R40.2 R39.2 | R27.2 R26.2 3.45,25.5 1.78,27.18 1.78,28.06 C25.1
  Bottom 0.813: HALL1.1 63.75,20.57 | 63.75,20.57 63.75,13.72 | 63.75,13.72 HALL3.1 | C27.1 63.75,20.57 | C28.1 63.75,13.72 | ENCODER.1 1.27,28.57 C25.1 | SERVO.2 3.81,42.55 C26.1
  other vias: 35.31,9.4 33.78,9.4 35.31,8.64 34.54,9.4 33.78,8.64 34.54,8.64 9.65,56.13 9.65,55.37 9.65,54.61 9.65,53.85 36.07,9.4 36.07,8.64
  pour Route15: -0.51,58.42 65.53,58.42 65.53,51.05 65.53,-0.51 60.96,-0.51 -0.51,-0.51
  pour Bottom (isolate 0.254, no thermals): 33.53,11.43 35.31,11.43 35.31,9.91 36.32,9.91 36.32,8.38 33.53,8.38
  pour Bottom: 7.37,53.09 11.94,53.09 11.94,56.64 7.37,56.64
A2  (via drill 0.41)
  Top 0.254: 42.5,46.74 35.56,46.74
  Top 0.305: 35.56,46.74 35.44,46.86 C2.1 35.46,47.48 R2.2 35.46,44.96 34.54,44.96 33.78,44.2 31.37,44.2 v31.24,44.07 | 42.5,46.74 42.5,46.77 U1.6
  Bottom 0.305: U9.38 20.79,39.84 21.08,40.13 21.08,42.67 22.35,43.94 31.11,43.94 v31.24,44.07
A3  (via drill 0.41)
  Top 0.254: 42.5,34.8 35.56,34.8
  Top 0.305: 35.56,34.8 35.44,34.92 C5.1 35.44,33.55 R6.2 v36.96,33.53 | 42.5,34.8 42.5,34.83 U2.6
  Bottom 0.305: 21.59,38.42 U9.39 21.59,42.42 22.61,43.43 31.75,43.43 33.02,42.16 33.02,41.27 33.53,40.77 36.83,40.77 37.59,40.01 37.59,34.04 37.08,33.53 v36.96,33.53
A4  (via drill 0.41)
  Top 0.254: 40.89,22.86 36.07,22.86
  Top 0.305: U3.6 41.15,23.11 40.89,22.86 | 36.07,22.86 36.07,22.99 C9.1 | C9.1 35.44,21.61 R10.2 | v34.04,23.62 C9.1
  Route2 0.305: v26.67,27.94 26.67,35.81 v26.16,36.32
  Route15 0.305: v24.38,36.32 v26.16,36.32
  Bottom 0.305: v34.04,23.62 32,23.62 27.69,27.94 v26.67,27.94 | v24.38,36.32 23.62,36.32 22.35,37.59 22.35,39.04 U9.40
ATMEGAMISO  (via drill 0.41)
  Route15 0.305: v33.97,34.92 31.43,32.38 v31.43,31.11
  Bottom 0.305: v31.43,31.11 30.04,29.72 29.59,29.27 U9.11 | U5.12 34.4,35.35 v33.97,34.92
ATMEGAMOSI
  Bottom 0.305: U9.10 29.31,30.07 31.24,32 31.75,32 32.26,32.51 32.26,34.54 33.75,36.04 U5.13
ATMEGARESET  (via drill 0.41)
  Top 0.305: v14.92,8.57 11.07,4.72 R48.1
  Top 0.406: R48.1 10.39,4.7 C22.2 8,5.08 7.37,5.08 5.08,7.37 3.56,7.37 2.29,8.64 2.29,9.65 1.78,10.16 1.78,10.67 1.45,10.67 S1.2
  Route15 0.305: v27.94,28.57 27.62,28.89 v25.4,28.89
  Bottom 0.305: v27.94,28.57 36.83,28.57 37.47,29.21 37.47,29.84 35.7,31.61 U5.10 | v14.92,8.57 27.69,21.34 27.69,25.91 27.3,26.29 25.02,26.29 24.79,26.52 U9.13 24.79,28.23 24.77,28.26 v25.4,28.89
ATMEGASCK  (via drill 0.41)
  Route15 0.305: v34.29,31.75 33.02,30.48 29.21,30.48 v28.89,30.8
  Bottom 0.305: v34.29,31.75 35.05,32.51 U5.11 | U9.9 28.82,30.87 v28.89,30.8
ATMEGASCL  (via drill 0.41)
  Top 0.305: U10.1 13.83,42.81 14.22,42.42 16.51,42.42 16.73,42.64 | 16.73,42.64 16.76,42.67 16.76,43.18 16.92,43.18 R43.1 | v21.14,31.05 21.14,33.85 16.83,38.16 16.83,42.55 16.73,42.64
  Bottom 0.305: U9.18 20.79,28.66 20.83,28.7 20.83,30.73 v21.14,31.05
ATMEGASDA  (via drill 0.41)
  Top 0.305: U10.4 15.13,45.58 15.49,45.21 18.54,45.21 19.05,44.7 19.05,44.45 19.71,43.79 R30.1 20.32,43.28 v20.32,40.32
  Route2 0.305: v20.32,40.32 20.32,34.04 20.83,33.53 20.83,32.77 20.32,32.26 20.32,31.11 v20.07,30.86
  Bottom 0.305: U9.19 19.99,28.63 20,28.64 20,30.8 v20.07,30.86
D0  (via drill 0.41)
  Route15 0.305: v55.63,31.5 v48.26,31.5 | v29.97,26.67 24.64,26.67 23.88,27.43 v16.76,27.43
  Bottom 0.305: v55.63,31.5 55.37,31.24 55.37,23.37 56.13,22.61 56.13,20.32 | v48.26,31.5 42.93,31.5 40.13,28.7 38.61,28.7 37.34,27.43 30.73,27.43 v29.97,26.67 | v16.76,27.43 16.76,28.19 17.27,28.7 18.8,28.7 19.19,28.31 U9.20
  Bottom 0.406: HALL1.3 58.67,22.1 56.9,20.32 56.13,20.32 R39.1
D1  (via drill 0.41)
  Route15 0.305: v55.63,18.54 54.86,19.3 v48.26,19.3 | v28.45,24.13 27.94,24.64 21.59,24.64 21.34,24.89 20.32,24.89 19.05,26.16 v18.8,26.16
  Bottom 0.305: 56.13,16.76 56.13,18.03 v55.63,18.54 | v48.26,19.3 48.26,20.83 47.24,21.84 40.39,21.84 39.5,20.95 35.18,20.95 34.29,20.07 32.77,20.07 28.7,24.13 v28.45,24.13 | 18.54,26.42 v18.8,26.16 18.39,26.57 U9.21
  Bottom 0.406: R40.1 56.13,16.76 58.17,16.76 HALL2.3
D4  (via drill 0.41)
  Top 0.305: v20.83,26.16 18.54,28.45 v18.54,29.34
  Route2 0.305: v34.04,22.35 v34.04,20.83
  Route15 0.305: v28.45,25.15 21.84,25.15 v20.83,26.16
  Bottom 0.305: v28.45,25.15 32.77,20.83 v34.04,20.83 | v18.54,29.34 18.54,29.72 17.39,30.87 U9.25 | v34.04,22.35 38.35,22.35 39.73,23.72 R9.1
D5
  Bottom 0.305: R27.1 8.89,28.6 ENCODER.4 12.81,35.67 U9.31
D6  (via drill 0.41)
  Route2 0.305: v22.61,42.42 v22.61,35.56
  Route15 0.305: v22.61,42.42 23.11,42.93 v33.27,42.93
  Bottom 0.305: v22.61,35.56 21.59,35.56 18.54,32.51 15.83,32.51 U9.27 | v33.27,42.93 34.04,42.16 36.58,42.16 38.35,43.94 40.89,43.94 R1.1
D7  (via drill 0.41)
  Route2 0.305: v46.99,14.99 46.99,36.07 v46.48,36.58
  Route15 0.305: v46.99,14.99 v56.13,14.99 | v28.7,37.34 31.5,37.34 32.26,36.58 v46.48,36.58
  Bottom 0.305: v56.13,14.99 56.13,13.21 R41.1 | v28.7,37.34 27.43,37.34 27.43,37.32 U9.1
  Bottom 0.406: HALL3.3 58.67,12.19 57.66,13.21 56.13,13.21
D8  (via drill 0.41)
  Top 0.305: v9.91,29.72 6.86,29.72 6.35,30.23 ENCODER.3
  Bottom 0.305: R26.1 6.35,28.35 ENCODER.3 | U9.28 14.22,33.27 10.67,29.72 v9.91,29.72
D9  (via drill 0.41)
  Route15 0.305: v19.56,53.85 v22.35,53.85
  Bottom 0.305: v19.56,53.85 17.02,51.31 17.02,40.89 16.83,40.7 16.83,38.16 17.02,37.97 17.02,34.54 16.55,34.07 U9.29 | v22.35,53.85 23.62,52.58 36.83,52.58 37.91,51.5 37.91,47.43 39.88,45.47 41.91,45.47 42.93,44.45 43.18,44.45 43.59,44.04 R3.1
D10  (via drill 0.41)
  Route2 0.305: v31.24,36.58 29.46,34.8 v28.7,34.8
  Route15 0.305: v45.47,35.81 45.21,36.07 31.75,36.07 v31.24,36.58 | v13.72,34.8 v28.7,34.8
  Bottom 0.305: v45.47,35.81 45.47,35.31 44.7,34.54 43.94,34.54 R7.1 | v13.72,34.8 15.75,34.8 15.75,34.83 U9.30
D11
  Bottom 0.305: U9.12 25.59,27.18 27.43,27.18 33.02,21.59 39.12,21.59 40.01,22.48 43.56,22.48 43.94,22.86 R11.1
D12  (via drill 0.41)
  Route15 0.305: v30.23,27.94 28.19,29.97 v25.65,29.97
  Bottom 0.305: v30.23,27.94 37.08,27.94 38.1,28.96 38.1,33.53 39.12,34.54 40.89,34.54 R5.1 | v25.65,29.97 23.37,29.97 21.59,31.75 16.76,31.75 16.69,31.67 U9.26
D13
  Bottom 0.305: U9.32 12.6,36.47 10.41,34.29 7.87,34.29 7.62,34.54 7.62,42.16 12.19,46.74 12.19,51.05 11.68,51.56 10.16,51.56 9.65,51.05 9.65,48.26 6.86,45.47 SERVO.3
GND  (via drill 0.41)
  Top 0.305: C32.2 17.78,32 18.29,32.51 v18.29,33.27 | C30.2 22.86,37.08 22.35,36.58 v21.59,36.58 | C39.2 25.4,34.54 25.91,34.04 v25.91,33.27 | C31.2 22.86,29.46 22.35,29.97 v21.59,29.97
  Top 0.406: S2.P2.2 54.86,1.91 v54.86,0.76 | v0.76,6.6 0.76,7.44 S1.1 | J2.5 2.26,18 1.7,17.45 J2.GND2
  Top 0.61: C40.2 42.42,16.26 v42.67,16
  Top 0.813: R10.1 32.61,23.6 C9.2 C10.2 32.61,25.93 R12.1 32.61,28.8 33.27,29.46 v33.78,29.46 v34.54,29.46 v35.31,29.46 v36.07,29.46 v36.83,29.46 38.22,29.46 C14.2 38.48,29.46 v39.88,29.46 U3.1 42.72,30.65 C12.2 | R2.1 32.64,45.49 C2.2 C1.2 32.61,49.81 R4.1 32.61,52.68 33.27,53.34 v33.78,53.34 v34.54,53.34 v35.31,53.34 v36.07,53.34 v36.83,53.34 38.22,53.34 C4.2 38.48,53.34 v39.88,53.34 U1.1 42.72,54.53 C3.2 | R6.1 32.64,33.55 C5.2 C6.2 32.61,37.87 R8.1 32.61,40.74 33.27,41.4 v33.78,41.4 v34.54,41.4 v35.31,41.4 v36.07,41.4 v36.83,41.4 38.22,41.4 C8.2 38.48,41.4 v39.88,41.4 U2.1 42.72,42.59 C7.2 | D2.A 13.72,10.92 v14.48,10.16 15.14,9.5 R14.1 16.51,7.24 C17.2 16.89,5.21 17.55,4.54 BATT.2 | C34.2 R36.1 39.37,6.76 39.37,6.1 38.86,5.59 U7.P3
  Bottom 0.305: C24.2 30.6,41.91 30.73,41.91 v30.73,40.64 | U9.43 24.79,40.28 v24.89,40.39 | U9.5 28.92,34.07 v28.96,34.04 | U9.35 18.39,40.23 v18.54,40.39 | U9.15 23.19,26.24 v23.11,26.16 | U9.23 14.54,29.27 v14.48,29.21 | U5.7 37,43.77 v37.08,43.69 | v33.02,32 33.02,32.77 33.66,33.4 C21.2 | C20.2 v25.4,42.16 | C23.2 v29.72,45.47
  Bottom 0.406: U4.4 U4.3 U4.2 U4.1 57.34,2.48 v57.4,2.54 | C18.2 26.11,25.08 XTAL1.GND2 23.84,23.91 v23.88,23.88 | C19.2 17.98,22.68 XTAL1.GND4 19.84,23.84 v19.81,23.88 | 61.08,20.45 61.08,20.57 C27.2 | J1.39 56.63,51.55 v57.4,52.32 | v24.64,54.86 24.57,54.93 23.72,54.93 J1.14 | J1.20 31.23,53.35 v31.24,53.34 | J1.9 18.53,51.55 v18.8,51.82 | J1.25 38.85,52.06 v38.86,52.07 | v44.96,55.37 44.26,55.37 J1.30 | v13.72,53.34 13.72,54.77 J1.6 | v50.04,55.37 49.34,55.37 J1.34 | R38.1 34.04,6.5 v34.04,5.33 | R37.1 42.32,7.77 v42.93,8.38
  Bottom 0.61: C38.2 C29.2 v51.82,11.43
  Bottom 0.813: C36.- 41.4,14.61 C37.2 | HALL3.2 61.21,13.72 | 61.21,13.72 61.21,20.32 | 61.21,20.32 HALL1.2 | 61.08,20.45 61.21,20.32 | C28.2 61.21,13.72 | IMU.4 8.89,35.69 C33.2 | ENCODER.2 3.81,28.83 C25.2 | SERVO.1 1.27,42.29 C26.2
  other vias: 2.79,18.03 3.3,13.46 6.1,14.48
  pour Route2: -0.25,58.17 65.28,58.17 65.28,-0.25 -0.25,-0.25
  pour Top (rank 6): -1.02,-1.02 -1.02,58.42 66.29,58.42 66.29,-1.02
IMUSCL
  Top 0.305: U10.6 13.83,45.47 10.67,45.47 9.91,44.7 9.91,44.45 9.8,44.45 R44.1 8.79,43.43 4.57,43.43 1.27,40.13 IMU.1
IMUSDA
  Top 0.305: U10.3 15.13,44.56 14.73,44.96 12.45,44.96 12.19,44.7 12.19,44.45 11.53,43.79 R31.1 10.82,43.18 10.67,43.18 10.67,42.93 10.16,42.42 6.1,42.42 3.81,40.13 IMU.2
N$1  (via drill 0.41)
  Top 0.305: U1.3 v39.88,50.8
  Bottom 0.305: v39.88,50.8 40.13,50.55 40.13,47.65 R1.2
N$2
  Bottom 0.305: 39.48,9.29 U6.3 38.72,8.75 37.85,7.87 37.85,7.37 37.34,6.86 R38.2 37.24,9.5 36,10.73 U11.1
N$3
  Bottom 0.406: U9.16 22.39,23.58 23.11,22.86 23.66,22.86 XTAL1.P3 | XTAL1.P3 25.71,22.68 C18.1 | R13.1 23.27,22.1 XTAL1.P3
N$4  (via drill 0.41)
  Top 0.305: U1.2 v45.72,52.07
  Bottom 0.305: v45.72,52.07 45.21,51.56 45.21,48.51 44.7,48.01 44.7,47.65 R3.2
N$5
  Top 0.254: 36.83,47.62 37.21,47.24 39.5,47.24 40.26,48.01
  Top 0.305: 36.83,47.62 36.83,48.77 36.32,49.28 35.94,49.28 C1.1 35.46,49.81 R4.2 | 40.26,48.01 40.64,48.01 40.89,48.26 U1.5
N$6  (via drill 0.41)
  Top 0.305: U2.3 v39.88,38.86
  Bottom 0.305: v39.88,38.86 40.13,38.61 40.13,38.25 R5.2
N$7
  Bottom 0.406: U9.17 21.59,25.4 21.08,24.89 | 21.08,24.89 20.03,24.89 XTAL1.P1 17.58,25.08 C19.1 | R13.2 20.42,20.68 20.83,21.08 20.83,21.34 21.59,22.1 21.59,24.38 21.08,24.89
N$8  (via drill 0.41)
  Top 0.305: v59.94,22.1 59.94,14.22 57.4,11.68 57.4,11.43 47.88,1.91 S2.P2.1
  Bottom 0.305: U9.33 15.24,37.27 | 15.24,37.27 11.34,37.27 R16.1 | v59.94,22.1 59.94,25.65 57.91,27.69 57.91,38.61 48.07,48.45 48.07,51.75 46.48,53.34 43.43,53.34 42.67,54.1 42.67,56.01 42.04,56.64 15.37,56.64 14.99,56.26 14.99,47.5 15.24,47.24 15.24,37.27
N$9  (via drill 0.41)
  Top 0.305: U2.2 v45.72,40.13
  Bottom 0.305: v45.72,40.13 44.7,39.12 44.7,38.25 R7.2
N$10
  Top 0.406: LED1.A 1.86,12.11 3.56,10.41 3.91,10.41 R15.1
N$11
  Top 0.254: 36.83,35.69 37.21,35.31 39.5,35.31 40.26,36.07
  Top 0.305: 36.83,35.69 36.83,36.83 36.32,37.34 35.94,37.34 C6.1 35.46,37.87 R8.2 | 40.26,36.07 41.91,36.07 42.16,36.32 U2.5
N$12  (via drill 0.41)
  Top 0.406: v54.86,4.83 54.86,3.3 54.86,3.17 S2.P1.2
  Bottom 0.406: U4.7 55.24,5.21 v54.86,4.83
N$13
  Bottom 0.305: U6.6 U6.5 U6.2 40.13,8.13 40.13,7.26 40.13,6.86 R37.2
N$14
  Top 0.305: LED1.B 1.92,13.06 3.3,11.68 4.83,11.68 5.22,12.08 U12.6
N$15  (via drill 0.41)
  Top 0.305: U3.3 40.39,26.92 39.88,27.43 v39.88,27.94
  Bottom 0.305: v39.88,27.94 40.13,27.69 40.13,26.57 R9.2
N$16
  Top 0.305: J2.2 6.85,19.95 | R18.1 7.11,20.47 6.85,20.21
  Top 0.406: 6.85,19.95 6.85,20.21
N$17  (via drill 0.41)
  Top 0.305: U3.2 v45.72,28.19
  Bottom 0.305: v45.72,28.19 44.7,27.18 44.7,26.57 R11.2
N$18
  Top 0.254: 36.83,23.75 37.21,23.37 39.5,23.37 40.26,24.13
  Top 0.305: R12.2 35.46,25.93 | 35.46,25.93 C10.1 | 35.46,25.93 35.99,25.4 36.32,25.4 36.83,24.89 36.83,23.75 | 40.26,24.13 41.66,24.13 41.91,24.38 U3.5
N$19
  Bottom 0.305: U9.42 24,39.08 C20.1
N$20
  Bottom 0.305: U9.6 30.6,33.27 C21.1
N$21
  Top 0.813: U8.1 23.62,17.79 23.62,17.78 21.84,17.78 20.07,16 17.27,16 16.51,15.24 D1.A R14.2
N$22
  Top 0.305: LED1.G 3.47,14.81 U12.3
N$23  (via drill 0.41)
  Top 0.305: R18.2 7.26,17.63 7.87,17.02 7.87,16.76 8.26,16.38 10.67,16.38 11.05,16.76 11.05,17.72 18.41,25.08 20.89,25.08 24.38,28.57 24.38,30.48 23.88,30.99 v23.88,35.56
  Bottom 0.305: U9.3 23.99,35.67 v23.88,35.56
N$24  (via drill 0.41)
  Top 0.305: v20.19,33.21 20.19,31.88 11.62,23.3 11.62,19.24 10.67,18.29 9.91,18.29 9.91,17.88 R17.2
  Bottom 0.305: v20.19,33.21 21.86,34.87 U9.4
N$25
  Top 0.305: J2.3 8.89,19.3 9.14,19.56 9.14,19.96 R17.1
N$41
  Top 0.813: U7.P5 42.27,6.81 R36.2
OUT1
  Top 0.813: U1.8 U1.4 38.35,49.53 | C4.1 38.35,49.53 | 38.35,49.53 C13.2
  pour Top (no thermals): 47.24,54.86 56.64,54.86 64.77,46.74 64.77,39.88 60.71,39.88 56.39,44.2 47.24,44.2
OUT2
  Top 0.813: U2.8 U2.4 38.35,37.59 | C8.1 38.35,37.59 | 38.35,37.59 C11.2
  pour Top (no thermals): 47.24,42.93 56.64,42.93 60.45,39.12 64.77,39.12 64.77,36.07 60.45,36.07 56.64,32.26 47.24,32.26
OUT3
  Top 0.813: U3.8 U3.4 38.35,25.65 | C14.1 38.35,25.65 | 38.35,25.65 C15.2
  pour Top (no thermals): 47.24,30.99 56.39,30.99 60.71,35.31 64.77,35.31 64.77,28.7 56.39,20.32 47.24,20.32
RPILEDB  (via drill 0.41)
  Top 0.305: U12.2 4.57,14.99 5.84,16.26 5.84,18.54 6.1,18.8 10.29,18.8 11.05,19.56 11.05,37.72 v12.19,38.86
  Bottom 0.305: v12.19,38.86 13.02,39.69 13.02,48.26 13.45,48.69 J1.5
RPILEDG  (via drill 0.41)
  Top 0.305: U12.5 4.57,13.08 4.95,13.46 6.1,13.46 v8.26,15.62
  Bottom 0.305: v8.26,15.62 8.26,22.23 10.67,24.64 10.67,26.35 10.1,26.92 5.78,26.92 5.46,27.24 5.46,29.97 5.08,30.35 5.08,34.29 4.83,34.54 4.83,36.58 5.08,36.83 5.08,40.64 10.91,46.47 J1.3
RPIMISO
  Bottom 0.305: U5.3 34.4,46.37 33.78,46.99 33.78,49.95 J1.21
RPIMOSI
  Bottom 0.305: J1.19 31.24,49.95 31.24,48.51 33.75,46 U5.2
RPIRESET
  Bottom 0.305: U5.5 35.7,46.37 37.27,47.94 37.27,51.24 36.7,51.82 23.11,51.82 21.07,53.86 J1.12
RPIROMSCL  (via drill 0.41)
  Route15 0.305: v54.86,11.68 54.86,6.86 v54.1,6.1
  Bottom 0.305: R46.1 50.44,8.38 51.31,8.38 52.07,9.14 53.59,9.14 53.98,8.76 U4.6 54.1,7.55 v54.1,6.1 | v54.86,11.68 54.86,40.64 47.43,48.07 47.43,51.37 46.1,52.7 42.48,52.7 41.72,53.47 41.72,54.71 J1.28
RPIROMSDA  (via drill 0.41)
  Top 0.305: v49.02,6.86 v49.02,18.03
  Bottom 0.305: U4.5 52.7,6.48 52.07,5.84 R45.1 50.29,5.84 49.78,6.35 49.53,6.35 v49.02,6.86 | v49.02,18.03 49.02,41.66 45.21,45.47 42.93,45.47 42.42,45.97 42.42,47.75 41.39,48.78 J1.27
RPISCK
  Bottom 0.305: U5.4 35.05,46.48 36.32,47.75 36.32,49.95 J1.23
VBATT
  pour Top (rank 2, no thermals): 17.78,16.26 17.78,0.51 43.69,0.51 43.69,16.26
VBUS  (via drill 0.41)
  Top 0.305: J2.1 3.53,20.6 3.3,20.83 3.3,22.61 5.08,24.38 5.08,39.88 5.84,40.64 12.38,40.64 14.48,38.54 v14.48,32.51
  Route15 0.305: v14.48,32.51 14.52,32.47 v19.46,32.47
  Bottom 0.305: U9.7 v19.46,32.47
VOUT  (via drill 0.41)
  Top 0.61: C34.1 33.91,7.37 v32.77,7.37
  pour Bottom (rank 4, no thermals): 32,14.48 43.69,14.48 43.69,0.51 32,0.51
VPP
  Top 0.813: D2.C 14.18,17.7
  pour Top (no thermals): 12.7,16.76 12.7,18.54 22.86,28.7 22.86,48.77 30.73,56.64 42.67,56.64 42.67,16.76

### Text on the board
tPlace: Pi Car Control Board / v2.0 / WashU ESE Dept / May 2017 | 1: EEPROM WP Enable / 2: Bootloader Enable